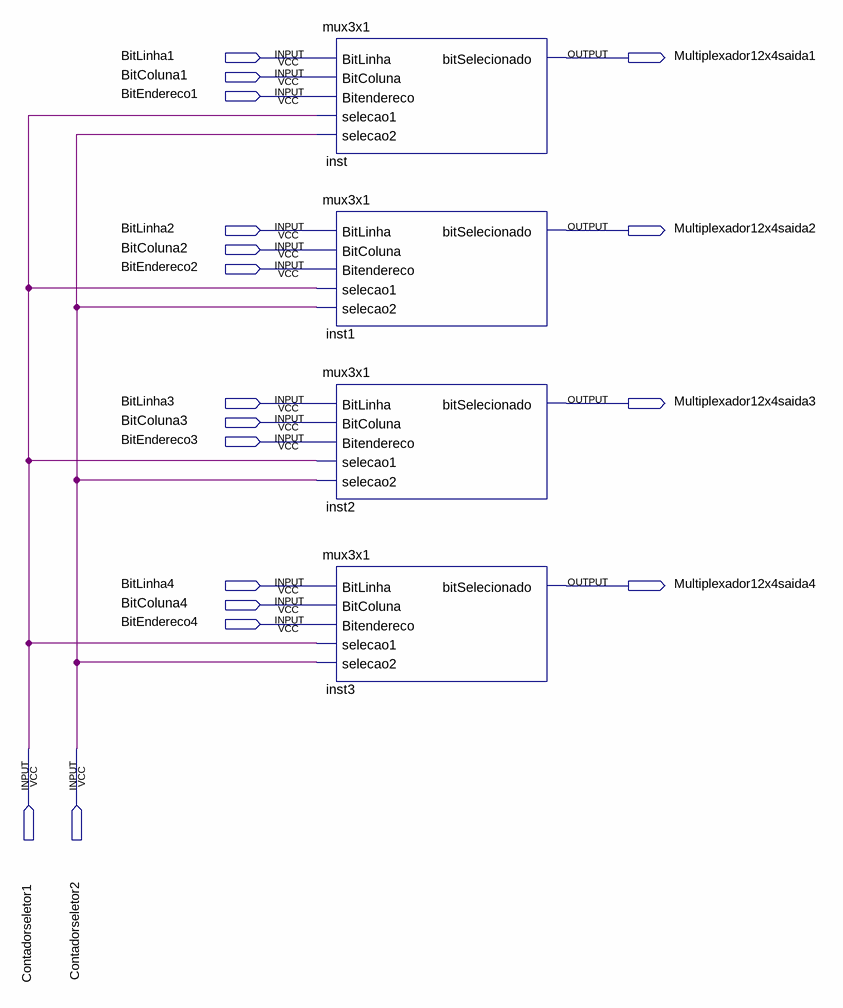
[diagram p0: schematic sheet]
// Quartus schematic Multiplexador12x4.bdf as structural Verilog: 4 symbols, 18 pins
module Multiplexador12x4 (
  input  BitLinha1,
  input  BitColuna1,
  input  BitEndereco1,
  input  BitLinha2,
  input  BitColuna2,
  input  BitEndereco2,
  input  BitLinha3,
  input  BitColuna3,
  input  BitEndereco3,
  input  BitLinha4,
  input  BitColuna4,
  input  BitEndereco4,
  input  Contadorseletor1,
  input  Contadorseletor2,
  output Multiplexador12x4saida1,
  output Multiplexador12x4saida2,
  output Multiplexador12x4saida3,
  output Multiplexador12x4saida4
);

  mux3x1 inst (
    .BitLinha(BitLinha1), .BitColuna(BitColuna1), .Bitendereco(BitEndereco1), .selecao1(Contadorseletor1),
    .selecao2(Contadorseletor2), .bitSelecionado(Multiplexador12x4saida1));
  mux3x1 inst1 (
    .BitLinha(BitLinha2), .BitColuna(BitColuna2), .Bitendereco(BitEndereco2), .selecao1(Contadorseletor1),
    .selecao2(Contadorseletor2), .bitSelecionado(Multiplexador12x4saida2));
  mux3x1 inst2 (
    .BitLinha(BitLinha3), .BitColuna(BitColuna3), .Bitendereco(BitEndereco3), .selecao1(Contadorseletor1),
    .selecao2(Contadorseletor2), .bitSelecionado(Multiplexador12x4saida3));
  mux3x1 inst3 (
    .BitLinha(BitLinha4), .BitColuna(BitColuna4), .Bitendereco(BitEndereco4), .selecao1(Contadorseletor1),
    .selecao2(Contadorseletor2), .bitSelecionado(Multiplexador12x4saida4));
endmodule
